# EAGLE design motorplank (EAGLE 6.2)
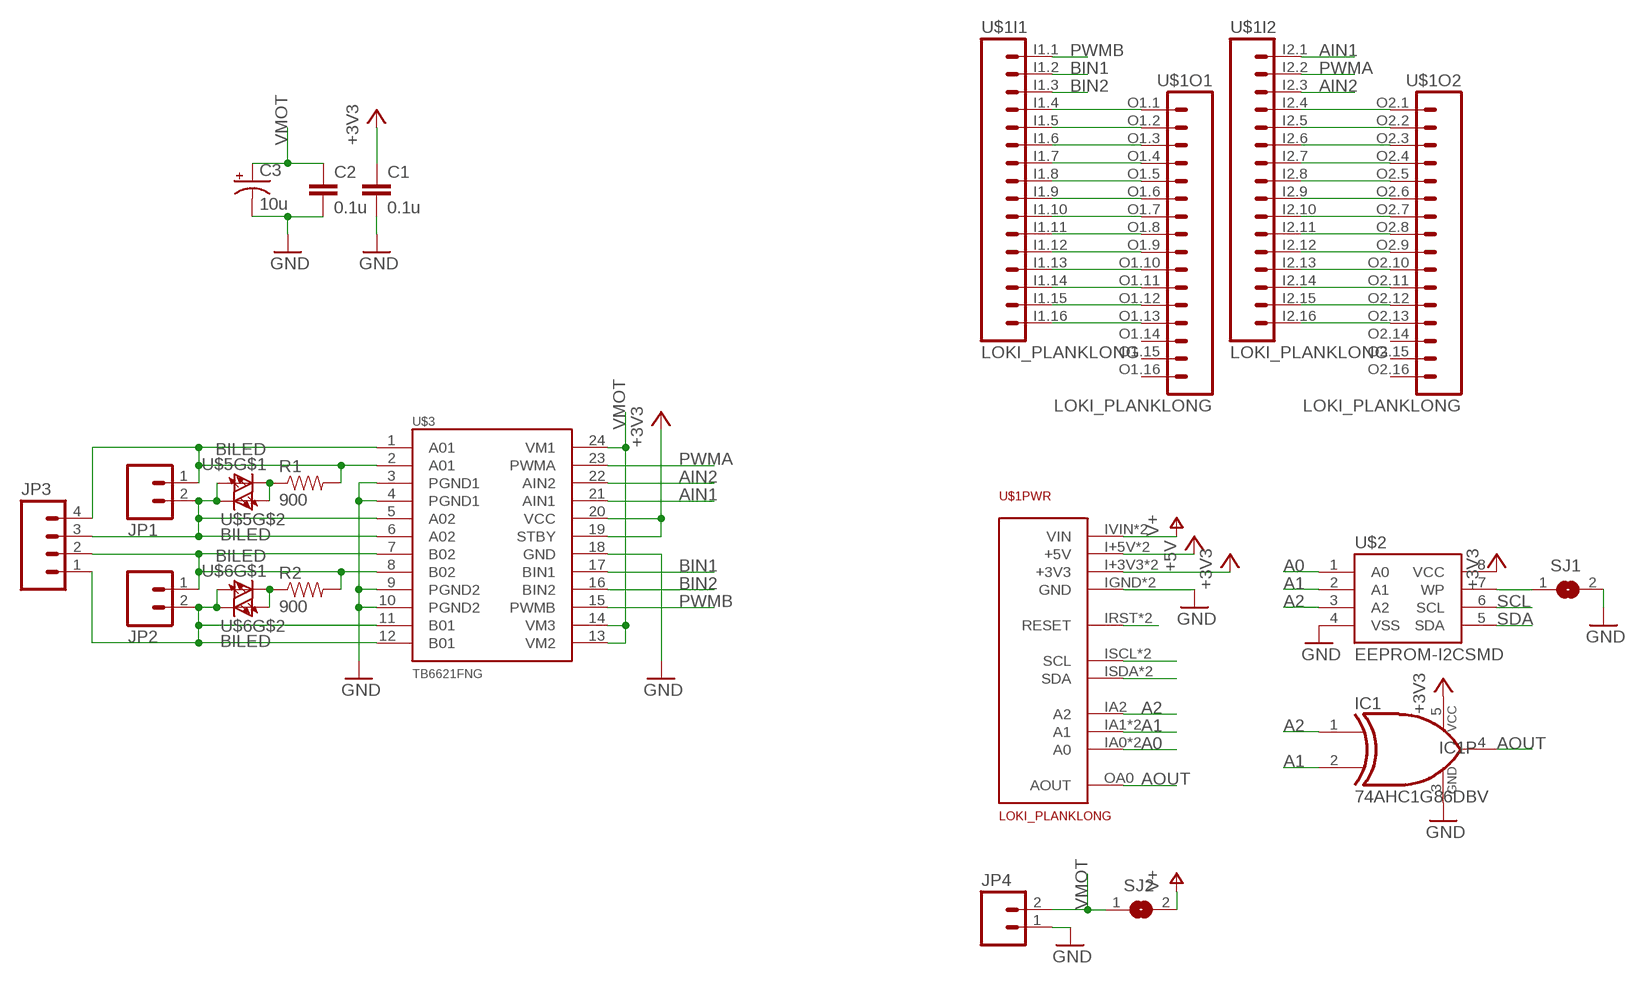
[diagram p0: schematic, sheet 1]

## Parts
C1  0.1u  CAP0805  [0805]
C2  0.1u  CAP0805  [0805]
C3  10u  CAP_POLC  [PANASONIC_C]
IC1  74AHC1G86DBV  [SOT23-5]
JP1  M023.5MM  [SCREWTERMINAL-3.5MM-2]
JP2  M023.5MM  [SCREWTERMINAL-3.5MM-2]
JP3  M04PTH  [1X04]
JP4  M023.5MM  [SCREWTERMINAL-3.5MM-2]
R1  900  RESISTOR0805-RES  [0805]
R2  900  RESISTOR0805-RES  [0805]
SJ1  SJ  [SJ]
SJ2  SJ  [SJ]
U$1  LOKI_PLANKLONG  [PLANK_LONG]
U$2  EEPROM-I2CSMD  [SO08]
U$3  TB6621FNG  [SSOP24]
U$5  BILED  [BILED]
U$6  BILED  [BILED]

## Nets
+3V3: C1.1 IC1.5(VCC) U$1.I+3V3(PWR:+3V3) U$1.O+3V3(PWR:+3V3) U$2.8(VCC) U$3.19(STBY) U$3.20(VCC)
+5V: U$1.I+5V(PWR:+5V) U$1.O+5V(PWR:+5V)
A0: U$1.IA0(PWR:A0) U$1.OA1(PWR:A0) U$2.1(A0)
A1: IC1.2(I1) U$1.IA1(PWR:A1) U$1.OA2(PWR:A1) U$2.2(A1)
A2: IC1.1(I0) U$1.IA2(PWR:A2) U$2.3(A2)
AIN1: U$1.I2.1 U$3.21(AIN1)
AIN2: U$1.I2.3 U$3.22(AIN2)
AOUT: IC1.4(O) U$1.OA0(PWR:AOUT)
BIN1: U$1.I1.2 U$3.17(BIN1)
BIN2: U$1.I1.3 U$3.16(BIN2)
GND: C1.2 C2.2 C3.- IC1.3(GND) JP4.1 SJ1.2 U$1.IGND(PWR:GND) U$1.OGND(PWR:GND) U$2.4(VSS) U$3.3(PGND1) U$3.4(PGND1) U$3.9(PGND2) U$3.10(PGND2) U$3.18(GND)
N$1: U$1.I1.16 U$1.O1.13
N$2: U$1.I1.15 U$1.O1.12
N$3: U$1.I1.14 U$1.O1.11
N$4: U$1.I1.13 U$1.O1.10
N$5: U$1.I1.12 U$1.O1.9
N$6: U$1.I1.11 U$1.O1.8
N$7: U$1.I1.10 U$1.O1.7
N$8: U$1.I1.9 U$1.O1.6
N$9: U$1.I1.8 U$1.O1.5
N$10: U$1.I1.7 U$1.O1.4
N$11: U$1.I1.6 U$1.O1.3
N$12: U$1.I1.5 U$1.O1.2
N$13: U$1.I1.4 U$1.O1.1
N$14: U$1.I2.16 U$1.O2.13
N$15: U$1.I2.15 U$1.O2.12
N$16: U$1.I2.14 U$1.O2.11
N$17: U$1.I2.13 U$1.O2.10
N$18: U$1.I2.12 U$1.O2.9
N$19: U$1.I2.11 U$1.O2.8
N$20: U$1.I2.10 U$1.O2.7
N$21: U$1.I2.9 U$1.O2.6
N$22: U$1.I2.8 U$1.O2.5
N$23: U$1.I2.7 U$1.O2.4
N$24: U$1.I2.6 U$1.O2.3
N$25: U$1.I2.5 U$1.O2.2
N$26: U$1.I2.4 U$1.O2.1
N$27: JP2.1 JP3.2 R2.2 U$3.7(B02) U$3.8(B02)
N$29: JP1.1 JP3.4 R1.2 U$3.1(A01) U$3.2(A01)
N$31: SJ1.1 U$2.7(WP)
N$32: U$1.IRST(PWR:RESET) U$1.ORST(PWR:RESET)
N$33: R1.1 U$5.A2(A) U$5.C1(C)
N$34: R2.1 U$6.A2(A) U$6.C1(C)
N$35: JP1.2 JP3.3 U$3.5(A02) U$3.6(A02) U$5.A1(A) U$5.C2(C)
N$36: JP2.2 JP3.1 U$3.11(B01) U$3.12(B01) U$6.A1(A) U$6.C2(C)
PWMA: U$1.I2.2 U$3.23(PWMA)
PWMB: U$1.I1.1 U$3.15(PWMB)
SCL: U$1.ISCL(PWR:SCL) U$1.OSCL(PWR:SCL) U$2.6(SCL)
SDA: U$1.ISDA(PWR:SDA) U$1.OSDA(PWR:SDA) U$2.5(SDA)
V+: SJ2.2 U$1.IVIN(PWR:VIN) U$1.OVIN(PWR:VIN)
VMOT: C2.1 C3.+ JP4.2 SJ2.1 U$3.13(VM2) U$3.14(VM3) U$3.24(VM1)
Unconnected: U$1.O1.14 U$1.O1.15 U$1.O1.16 U$1.O2.14 U$1.O2.15 U$1.O2.16

## Library data of the parts
C1 C2 = SparkFun-Passives:CAP: Capacitor Standard 0603 ceramic capacitor, and 0.1" leaded capacitor.
C3 = SparkFun-Passives:CAP_POL: Capacitor Polarized These are standard SMD and PTH capacitors. Normally 10uF, 47uF, and 100uF in electrolytic and tantalum varieties. Always verify the external diameter of the through hole cap, it varies with capacity, voltage, and manufacturer. The EIA devices should be standard.
IC1 = 74xx-little-us:74*1G86: 2-input EXCLUSIV-OR gate
JP1 JP2 JP4 = SparkFun-Connectors:M02: Header 2 Standard 2-pin 0.1" header. Use with straight break away headers (SKU : PRT-00116), right angle break away headers (PRT-00553), swiss pins (PRT-00743), machine pins (PRT-00117), and female headers (PRT-00115). Molex polarized connector foot print use with SKU : PRT-08233 with associated crimp pins and housings.
JP3 = SparkFun-Connectors:M04: Header 4 Standard 4-pin 0.1" header. Use with straight break away headers (SKU : PRT-00116), right angle break away headers (PRT-00553), swiss pins (PRT-00743), machine pins (PRT-00117), and female headers (PRT-00115). Molex polarized connector foot print use with SKU : PRT-08231 with associated crimp pins and housings. 1MM SMD Version SKU: PRT-10208
R1 R2 = SparkFun-Passives:RESISTOR: Resistor Basic schematic elements and footprints for 0603, 1206, and PTH resistors.
SJ1 SJ2 = jumper:SJ: SMD solder JUMPER
U$1 = loki:LOKI_PLANK
U$2 = SparkFun-DigitalIC:EEPROM-I2C: I2C EEPROM chips, 24LC256 (and others)
U$3 = SparkFun-PowerIC:TB6621FNG: Toshiba 1A dual motor driver
U$5 U$6 = nickparts:BILED

## Board
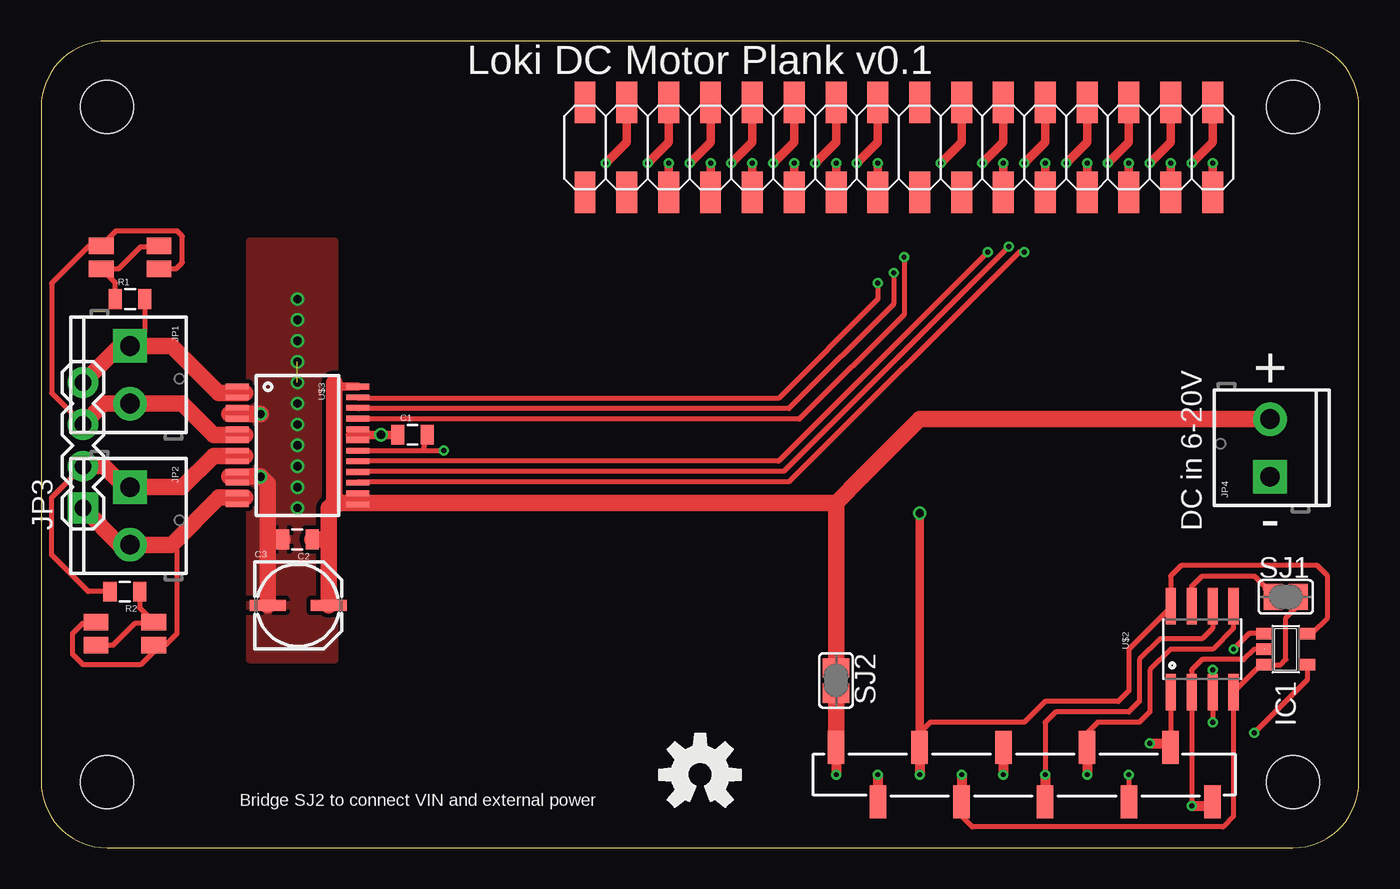
[diagram p1: board, top side]
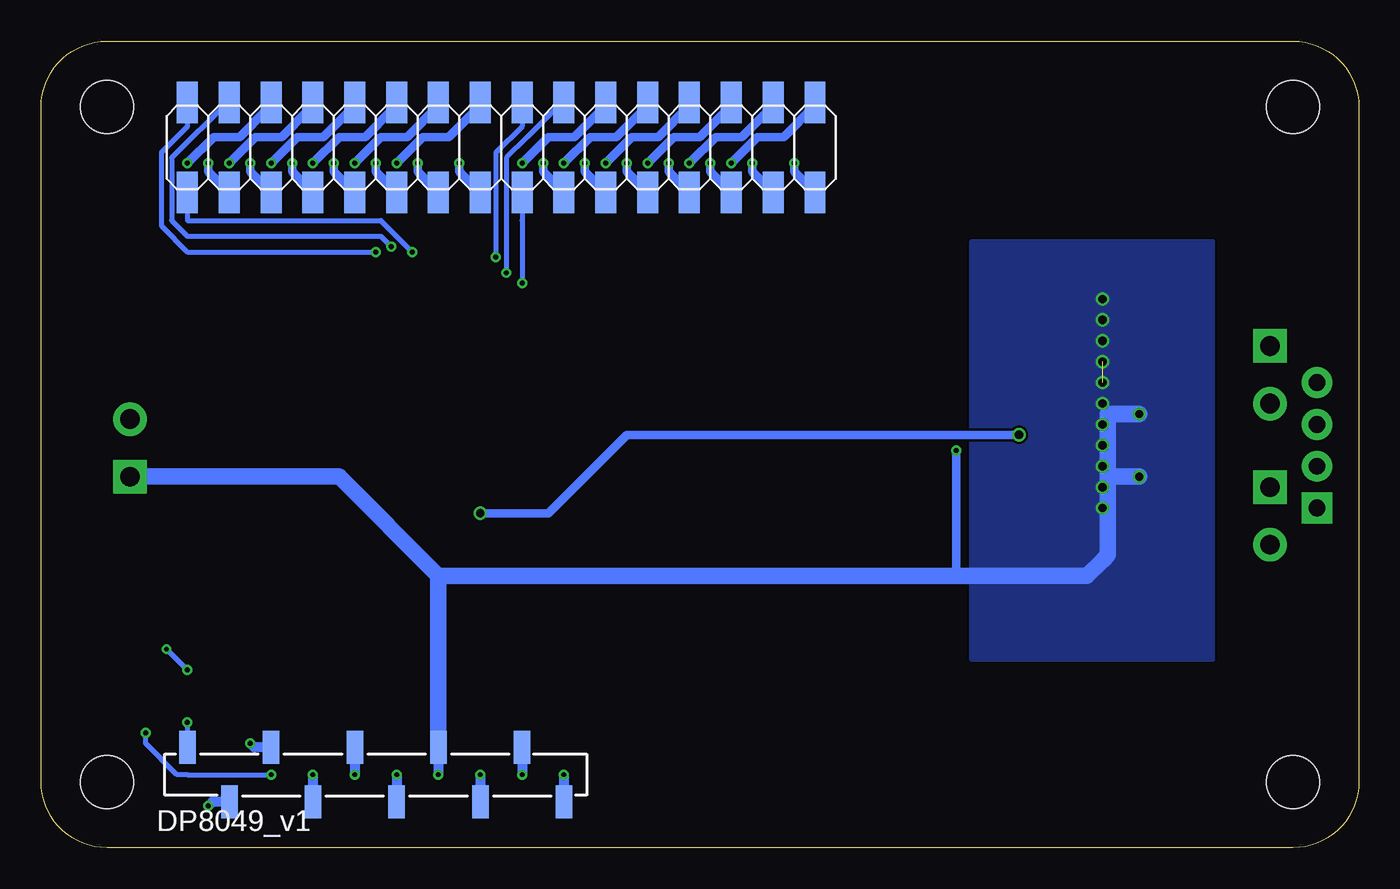
[diagram p2: board, bottom side, seen from below]

Size 80 x 49 mm. Coordinates in mm from the lower left corner, seen from the top.
Copper layers (1*16): Top 0.035mm / dielectric 1.5mm / Bottom 0.035mm
Design rules: minimum track width 6mil, minimum drill 0.3mm, track to track 6mil, track to pad 6mil, pad to pad 6mil, via to via 6mil, smd to smd 0mil, copper to edge 10mil, drill to drill 10mil, minimum pad ring 10mil, minimum via ring 6mil, stop-mask expansion 2mil, vias tented up to drill 100mil, thermal gap 10mil

### Footprints (pad centres in the part's own frame; a part is rotated, then mirrored left to right if it is on the bottom)
0805 = smd 0.8 x 1.2: 1 -0.9,0; 2 0.9,0
PANASONIC_C = smd 2.2 x 0.65: + 1.9,-0.2; - -1.8,-0.2
SOT23-5 = smd 0.69 x 0.99: 1 -0.95,-1.29; 2 0,-1.29; 3 0.95,-1.29; 4 0.95,1.3; 5 -0.95,1.3
SCREWTERMINAL-3.5MM-2 = drill 1.2 pad 2.032 square: 1 0,0 | drill 1.2 pad 2.032: 2 3.5,0
1X04 = drill 1.016 pad 1.88 square: 1 0,0 | drill 1.016 pad 1.88: 2 2.54,0; 3 5.08,0; 4 7.62,0
SJ = smd 1.168 x 1.6: 1 -0.762,0; 2 0.762,0
PLANK_LONG = smd 1.27 x 2.54 bottom: I1.1 71.12,45.275; I1.2 71.12,39.815; I1.3 68.58,45.275; I1.4 68.58,39.815; I1.5 66.04,45.275; I1.6 66.04,39.815; I1.7 63.5,45.275; I1.8 63.5,39.815; I1.9 60.96,45.275; I1.10 60.96,39.815; I1.11 58.42,45.275; I1.12 58.42,39.815; I1.13 55.88,45.275; I1.14 55.88,39.815; I1.15 53.34,45.275; I1.16 53.34,39.815; I2.1 50.8,45.275; I2.2 50.8,39.815; I2.3 48.26,45.275; I2.4 48.26,39.815; I2.5 45.72,45.275; I2.6 45.72,39.815; I2.7 43.18,45.275; I2.8 43.18,39.815; I2.9 40.64,45.275; I2.10 40.64,39.815; I2.11 38.1,45.275; I2.12 38.1,39.815; I2.13 35.56,45.275; I2.14 35.56,39.815; I2.15 33.02,45.275; I2.16 33.02,39.815 | smd 1 x 2 bottom: I+3V3 53.34,2.795; I+5V 50.8,6.095; IA0 66.04,6.095; IA1 68.58,2.795; IA2 71.12,6.095; IGND 55.88,6.095; IRST 58.42,2.795; ISCL 60.96,6.095; ISDA 63.5,2.795; IVIN 48.26,2.795 | smd 1.27 x 2.54: O1.1 71.12,45.275; O1.2 71.12,39.815; O1.3 68.58,45.275; O1.4 68.58,39.815; O1.5 66.04,45.275; O1.6 66.04,39.815; O1.7 63.5,45.275; O1.8 63.5,39.815; O1.9 60.96,45.275; O1.10 60.96,39.815; O1.11 58.42,45.275; O1.12 58.42,39.815; O1.13 55.88,45.275; O1.14 55.88,39.815; O1.15 53.34,45.275; O1.16 53.34,39.815; O2.1 50.8,45.275; O2.2 50.8,39.815; O2.3 48.26,45.275; O2.4 48.26,39.815; O2.5 45.72,45.275; O2.6 45.72,39.815; O2.7 43.18,45.275; O2.8 43.18,39.815; O2.9 40.64,45.275; O2.10 40.64,39.815; O2.11 38.1,45.275; O2.12 38.1,39.815; O2.13 35.56,45.275; O2.14 35.56,39.815; O2.15 33.02,45.275; O2.16 33.02,39.815 | smd 1 x 2: O+3V3 53.34,6.095; O+5V 50.8,2.795; OA0 66.04,2.795; OA1 68.58,6.095; OA2 71.12,2.795; OGND 55.88,2.795; ORST 58.42,6.095; OSCL 60.96,2.795; OSDA 63.5,6.095; OVIN 48.26,6.095 | hole 3.2: 4,4; 76,4; 76,45; 4,45
SO08 = smd 0.61 x 2.21: 1 -1.905,-2.616; 2 -0.635,-2.616; 3 0.635,-2.616; 4 1.905,-2.616; 5 1.905,2.616; 6 0.635,2.616; 7 -0.635,2.616; 8 -1.905,2.616
SSOP24 = smd 0.348 x 1.397: 1 -3.575,-3.656; 2 -2.925,-3.656; 3 -2.275,-3.656; 4 -1.625,-3.656; 5 -0.975,-3.656; 6 -0.325,-3.656; 7 0.325,-3.656; 8 0.975,-3.656; 9 1.625,-3.656; 10 2.275,-3.656; 11 2.925,-3.656; 12 3.575,-3.656; 13 3.575,3.656; 14 2.925,3.656; 15 2.275,3.656; 16 1.625,3.656; 17 0.975,3.656; 18 0.325,3.656; 19 -0.325,3.656; 20 -0.975,3.656; 21 -1.625,3.656; 22 -2.275,3.656; 23 -2.925,3.656; 24 -3.575,3.656
BILED = smd 1.5 x 1: A1 -1.75,0.7; A2 -1.75,-0.7; C1 1.75,0.7; C2 1.75,-0.7

### Placement (x,y rotation side)
C1  22.54,25.08 0 top
C2  15.56,18.73 180 top
C3  15.56,14.92 0 top
IC1  75.56,12.06 270 top
JP1  5.4,30.48 270 top
JP2  5.4,21.91 270 top
JP3  2.54,20.64 90 top
JP4  74.61,22.54 90 top
R1  5.4,33.34 0 top
R2  5.08,15.56 180 top
SJ1  75.56,15.24 0 top
SJ2  48.26,10.16 270 top
U$1  0,0 0 top
U$2  70.48,12.06 0 top
U$3  15.56,24.45 270 top
U$4  [OSHW-LOGO-M]  40,4.45 0 top
U$5  5.4,35.88 0 top
U$6  5.08,13.02 0 top

### Tracks (layer width: path | path; a pad name or v marks a point on that pad's centre or on a via)
+3V3  (via drill 0.3, 0.5)
  Top 0.305: IC1.5 77.15,13.02 78.11,13.97 78.11,16.51 77.47,17.14 69.22,17.14 68.58,16.51 U$2.8 68.58,14.61 66.04,12.06 66.04,9.53 65.41,8.89 60.96,8.89 59.69,7.62 53.97,7.62 53.34,6.99 U$1.O+3V3 | U$3.20 U$3.19 19.05,25.08
  Top 0.508: 53.34,6.99 v53.34,20.32 | 18.73,25.08 19.05,25.08 v20.64,25.08 C1.1
  Top 0.61: U$1.O+3V3 v53.34,4.45
  Bottom 0.508: v53.34,20.32 49.21,20.32 44.45,25.08 v20.64,25.08
  Bottom 0.61: v53.34,4.45 U$1.I+3V3
+5V  (via drill 0.3)
  Top 0.61: v50.8,4.45 U$1.O+5V
  Bottom 0.61: U$1.I+5V v50.8,4.45
A0  (via drill 0.3)
  Top 0.305: U$2.1 U$1.OA1
  Top 0.61: v67.31,6.35 68.33,6.35 U$1.OA1
  Bottom 0.61: U$1.IA0 67.06,6.09 v67.31,6.35
A1  (via drill 0.3)
  Top 0.305: v69.85,2.54 U$2.2 69.85,10.79 70.48,11.43 73.03,11.43 73.66,12.06 IC1.2
  Top 0.61: v69.85,2.54 70.87,2.54 U$1.OA2
  Bottom 0.61: U$1.IA1 69.59,2.79 v69.85,2.54
A2  (via drill 0.3)
  Top 0.305: v71.12,7.62 U$2.3 v71.12,10.79 | IC1.1 73.34,13.02 v72.39,12.06
  Bottom 0.305: v71.12,7.62 U$1.IA2 | v71.12,10.79 v72.39,12.06
AIN1  (via drill 0.3)
  Top 0.305: 19.25,26.04 U$3.21 19.25,26.04 | v52.39,35.88 52.39,32.38 46.04,26.04 19.25,26.04
  Bottom 0.305: U$1.I2.1 50.8,43.81 52.39,42.23 52.39,38.42 v52.39,35.88
AIN2  (via drill 0.3)
  Top 0.305: v51.75,34.92 51.75,33.02 45.4,26.67 19.27,26.67 U$3.22
  Bottom 0.305: U$1.I2.3 48.39,45.27 50.48,43.18 51.75,41.91 51.75,38.42 v51.75,34.92
AOUT  (via drill 0.3)
  Top 0.305: IC1.4 76.87,10.19 v73.66,6.99 | v66.04,4.45 U$1.OA0
  Bottom 0.305: v66.04,4.45 71.12,4.45 71.76,4.45 73.66,6.35 v73.66,6.99
BIN1  (via drill 0.3)
  Top 0.305: 19.24,23.5 U$3.17 19.24,23.5 | v57.47,36.2 44.77,23.5 19.24,23.5
  Bottom 0.305: U$1.I1.2 71.12,38.1 59.37,38.1 v57.47,36.2
BIN2  (via drill 0.3)
  Top 0.305: v58.74,36.51 45.08,22.86 19.25,22.86 U$3.16
  Bottom 0.305: U$1.I1.3 68.71,45.27 72.07,41.91 72.07,38.1 71.12,37.15 59.37,37.15 v58.74,36.51
GND  (via drill 0.3, 0.5)  (1 unrouted)
  Top 0.305: U$1.OGND 55.88,1.91 56.51,1.27 71.76,1.27 72.39,1.91 U$2.4 74.06,11.12 IC1.3 75.25,11.12 75.56,11.43 75.56,13.97 76.33,14.73 SJ1.2 | U$3.18 23.18,24.13 | 23.18,24.13 v24.45,24.13 | C1.2 23.18,24.13 | 11.43,26.35 U$3.3 11.43,26.67 U$3.4 | U$3.9 11.43,22.54 U$3.10
  Top 0.61: v55.88,4.45 U$1.OGND
  Top 1.016: v13.34,26.35 11.43,26.35 | 11.43,22.54 v13.34,22.54 13.76,22.12 13.76,18.73 | C3.- 13.76,18.73 | C2.2 13.76,18.73
  Bottom 0.508: 15.24,17.78 15.56,17.46 | v24.45,24.13 24.45,16.51
  Bottom 0.61: U$1.IGND v55.88,4.45
  Bottom 1.016: 55.88,16.51 U$1.IGND | 55.88,16.51 24.45,16.51 24.13,16.51 23.81,16.51 20,16.51 16.51,16.51 15.56,17.46 15.24,17.78 15.24,22.54 | 15.24,22.54 15.24,26.35 v13.34,26.35 | v13.34,22.54 15.24,22.54 | JP4.1 61.91,22.54 55.88,16.51
  other vias: 15.56,28.26 15.56,26.99 15.56,25.72 15.56,24.45 15.56,23.18 15.56,21.91 15.56,20.64 15.56,33.34 15.56,32.07 15.56,30.8 15.56,29.53
  pour Bottom: 23.5,36.83 8.89,36.83 8.89,11.43 23.5,11.43
  pour Top (isolate 0.254): 17.78,11.43 12.7,11.43 12.7,36.83 17.78,36.83
N$1  (via drill 0.3)
  Top 0.508: U$1.O1.13 55.88,42.86 v54.61,41.59
  Bottom 0.508: v54.61,41.59 54.61,41.09 U$1.I1.16
N$2  (via drill 0.3)
  Top 0.508: v58.42,41.59 U$1.O1.12
  Bottom 0.508: U$1.I1.15 53.34,45.09 55.24,43.18 56.83,43.18 v58.42,41.59
N$3  (via drill 0.3)
  Top 0.508: U$1.O1.11 58.42,42.86 v57.15,41.59
  Bottom 0.508: v57.15,41.59 57.15,41.09 U$1.I1.14
N$4  (via drill 0.3)
  Top 0.508: v60.96,41.59 U$1.O1.10
  Bottom 0.508: U$1.I1.13 55.88,45.09 57.78,43.18 59.37,43.18 v60.96,41.59
N$5  (via drill 0.3)
  Top 0.508: U$1.O1.9 60.96,42.86 v59.69,41.59
  Bottom 0.508: v59.69,41.59 59.69,41.09 U$1.I1.12
N$6  (via drill 0.3)
  Top 0.508: v63.5,41.59 U$1.O1.8
  Bottom 0.508: U$1.I1.11 58.42,44.77 58.74,44.77 60.32,43.18 61.91,43.18 v63.5,41.59
N$7  (via drill 0.3)
  Top 0.508: U$1.O1.7 63.5,42.86 v62.23,41.59
  Bottom 0.508: v62.23,41.59 62.23,41.09 U$1.I1.10
N$8  (via drill 0.3)
  Top 0.508: v66.04,41.59 U$1.O1.6
  Bottom 0.508: U$1.I1.9 60.96,44.77 61.28,44.77 62.87,43.18 64.45,43.18 v66.04,41.59
N$9  (via drill 0.3)
  Top 0.508: U$1.O1.5 66.04,42.86 v64.77,41.59
  Bottom 0.508: v64.77,41.59 64.77,41.09 U$1.I1.8
N$10  (via drill 0.3)
  Top 0.508: v68.58,41.59 U$1.O1.4
  Bottom 0.508: U$1.I1.7 63.5,44.77 63.82,44.77 65.41,43.18 66.99,43.18 v68.58,41.59
N$11  (via drill 0.3)
  Top 0.508: U$1.O1.3 68.58,42.86 v67.31,41.59
  Bottom 0.508: v67.31,41.59 67.31,41.09 U$1.I1.6
N$12  (via drill 0.3)
  Top 0.508: v71.12,41.59 U$1.O1.2
  Bottom 0.508: U$1.I1.5 66.04,44.77 66.36,44.77 67.95,43.18 69.53,43.18 v71.12,41.59
N$13  (via drill 0.3)
  Top 0.508: U$1.O1.1 71.12,42.86 v69.85,41.59
  Bottom 0.508: v69.85,41.59 69.85,41.09 U$1.I1.4
N$14  (via drill 0.3)
  Top 0.508: U$1.O2.13 35.56,42.86 v34.29,41.59
  Bottom 0.508: v34.29,41.59 34.29,41.09 U$1.I2.16
N$15  (via drill 0.3)
  Top 0.508: v38.1,41.59 U$1.O2.12
  Bottom 0.508: U$1.I2.15 33.02,45.09 34.92,43.18 36.51,43.18 v38.1,41.59
N$16  (via drill 0.3)
  Top 0.508: U$1.O2.11 38.1,42.86 v36.83,41.59
  Bottom 0.508: v36.83,41.59 36.83,41.09 U$1.I2.14
N$17  (via drill 0.3)
  Top 0.508: v40.64,41.59 U$1.O2.10
  Bottom 0.508: U$1.I2.13 35.56,45.09 37.46,43.18 39.05,43.18 v40.64,41.59
N$18  (via drill 0.3)
  Top 0.508: U$1.O2.9 40.64,42.86 v39.37,41.59
  Bottom 0.508: v39.37,41.59 39.37,41.09 U$1.I2.12
N$19  (via drill 0.3)
  Top 0.508: v43.18,41.59 U$1.O2.8
  Bottom 0.508: U$1.I2.11 38.1,45.09 40,43.18 41.59,43.18 v43.18,41.59
N$20  (via drill 0.3)
  Top 0.508: U$1.O2.7 43.18,42.86 v41.91,41.59
  Bottom 0.508: v41.91,41.59 41.91,41.09 U$1.I2.10
N$21  (via drill 0.3)
  Top 0.508: v45.72,41.59 U$1.O2.6
  Bottom 0.508: U$1.I2.9 40.64,45.09 42.54,43.18 44.13,43.18 v45.72,41.59
N$22  (via drill 0.3)
  Top 0.508: U$1.O2.5 45.72,42.86 v44.45,41.59
  Bottom 0.508: v44.45,41.59 44.45,41.09 U$1.I2.8
N$23  (via drill 0.3)
  Top 0.508: v48.26,41.59 U$1.O2.4
  Bottom 0.508: U$1.I2.7 43.18,45.09 45.08,43.18 46.67,43.18 v48.26,41.59
N$24  (via drill 0.3)
  Top 0.508: U$1.O2.3 48.26,42.86 v46.99,41.59
  Bottom 0.508: v46.99,41.59 46.99,41.09 U$1.I2.6
N$25  (via drill 0.3)
  Top 0.508: v50.8,41.59 U$1.O2.2
  Bottom 0.508: U$1.I2.5 45.72,45.09 47.62,43.18 49.21,43.18 v50.8,41.59
N$26  (via drill 0.3)
  Top 0.508: U$1.O2.1 50.8,42.86 v49.53,41.59
  Bottom 0.508: v49.53,41.59 49.53,41.09 U$1.I2.4
N$27
  Top 0.305: U$3.7 12.38,23.81 U$3.8 | R2.2 2.86,15.56 0.64,17.78 0.64,21.27 JP3.2
  Top 1.016: 12.38,23.81 10.48,23.81 8.57,21.91 JP2.1 5.08,21.91 3.81,23.18 JP3.2
N$29
  Top 0.305: U$3.2 U$3.1 12.38,27.62 | R1.2 6.3,31.38 JP1.1
  Top 1.016: 12.38,27.62 10.79,27.62 7.94,30.48 JP1.1 4.76,30.48 JP3.4
N$31
  Top 0.305: U$2.7 69.85,15.88 70.48,16.51 73.66,16.51 74.3,15.88 74.3,15.75 SJ1.1
N$32  (via drill 0.3)
  Top 0.61: U$1.ORST v58.42,4.45
  Bottom 0.61: v58.42,4.45 U$1.IRST
N$33
  Top 0.305: R1.1 4.5,34.33 U$5.A2 4.7,35.18 6.03,36.51 7.08,36.51 U$5.C1
N$34
  Top 0.305: R2.1 5.98,14.57 U$6.C1 6.77,13.65 5.71,13.65 4.38,12.32 U$6.A2
N$35
  Top 0.305: U$3.5 12.38,25.08 U$3.6 | JP3.3 0.64,27.62 0.64,34.29 2.92,36.58 U$5.A1 4.54,37.47 8.26,37.47 8.57,37.15 8.57,35.56 8.19,35.18 U$5.C2
  Top 1.016: 12.38,25.08 10.48,25.08 8.58,26.98 JP1.2 3.8,26.98 JP3.3
N$36
  Top 0.305: U$3.11 12.38,21.27 U$3.12 | U$6.A1 3.27,13.65 2.54,13.65 1.9,13.02 1.9,11.75 2.54,11.11 6.03,11.11 6.83,11.91 U$6.C2 7.55,12.32 8.26,13.02 8.26,18.08 7.93,18.41
  Top 1.016: 12.38,21.27 10.79,21.27 7.93,18.41 JP2.2 4.77,18.41 JP3.1
PWMA  (via drill 0.3)
  Top 0.305: v50.8,34.29 50.8,33.34 44.77,27.3 19.28,27.3 U$3.23
  Bottom 0.305: U$1.I2.2 50.8,38.1 v50.8,34.29
PWMB  (via drill 0.3)
  Top 0.305: v59.69,36.2 59.37,36.2 45.4,22.23 19.27,22.23 U$3.15
  Bottom 0.305: U$1.I1.1 71.12,43.81 72.71,42.23 72.71,38.1 72.71,37.78 71.12,36.2 v59.69,36.2
SCL  (via drill 0.3)
  Top 0.305: U$2.6 71.12,13.97 71.12,13.34 70.48,12.7 67.95,12.7 66.67,11.43 66.67,8.89 66.04,8.26 61.59,8.26 60.96,7.62 v60.96,4.45
  Top 0.61: v60.96,4.45 U$1.OSCL
  Bottom 0.61: U$1.ISCL v60.96,4.45
SDA  (via drill 0.3)
  Top 0.305: U$2.5 72.39,13.34 71.12,12.06 68.58,12.06 67.31,10.79 67.31,8.26 66.67,7.62 64.14,7.62 63.5,6.99 U$1.OSDA
  Top 0.61: U$1.OSDA v63.5,4.45
  Bottom 0.61: v63.5,4.45 U$1.ISDA
V+  (via drill 0.3)
  Top 0.61: U$1.OVIN v48.26,4.45
  Top 1.016: SJ2.2 U$1.OVIN
  Bottom 0.61: v48.26,4.45 U$1.IVIN
VMOT
  Top 0.305: U$3.14 U$3.13 19.13,20.87 19.05,20.95
  Top 0.508: U$3.24 18.02,28.02 17.78,28.26
  Top 1.016: SJ2.1 48.26,20.95 | 48.26,20.95 19.05,20.95 18.73,20.95 18.1,20.95 17.94,21.11 | 48.26,20.95 49.85,22.54 53.35,26.04 JP4.2 | 17.94,21.11 17.78,21.27 17.78,27.62 17.78,28.26 | C3.+ 17.46,18.73 | 17.46,18.73 17.46,20.63 17.94,21.11 | C2.1 17.46,18.73

### Text on the board
tPlace: Loki DC Motor Plank v0.1 | + | DC in 6-20V | - | Bridge SJ2 to connect VIN and external power